# Altium project SVPXGR740_3U.PrjPcb (part 8 of 8)

## Sheet MSP430_power_jtag.SchDoc: SVPXFMC Carrier 3U
size A4; CheckedBy: \; Author: G.Kasprowicz; CompanyName: ISE; DrawnBy: T.Przywozki; Organization: WUT ISE; Address1: Warsaw University of Technology; Address2: Nowowiejska 15/19 00-665 Warsaw; Revision: 1.0.; SheetNumber: 17; SheetTotal: 20; Project: SVPXFMC Carrier 3U; ModifiedBy: -; CheckedDate: -; Title2: MSP430 power and JTAG; DivGrp: ISE; Designer: G. Kasprowicz
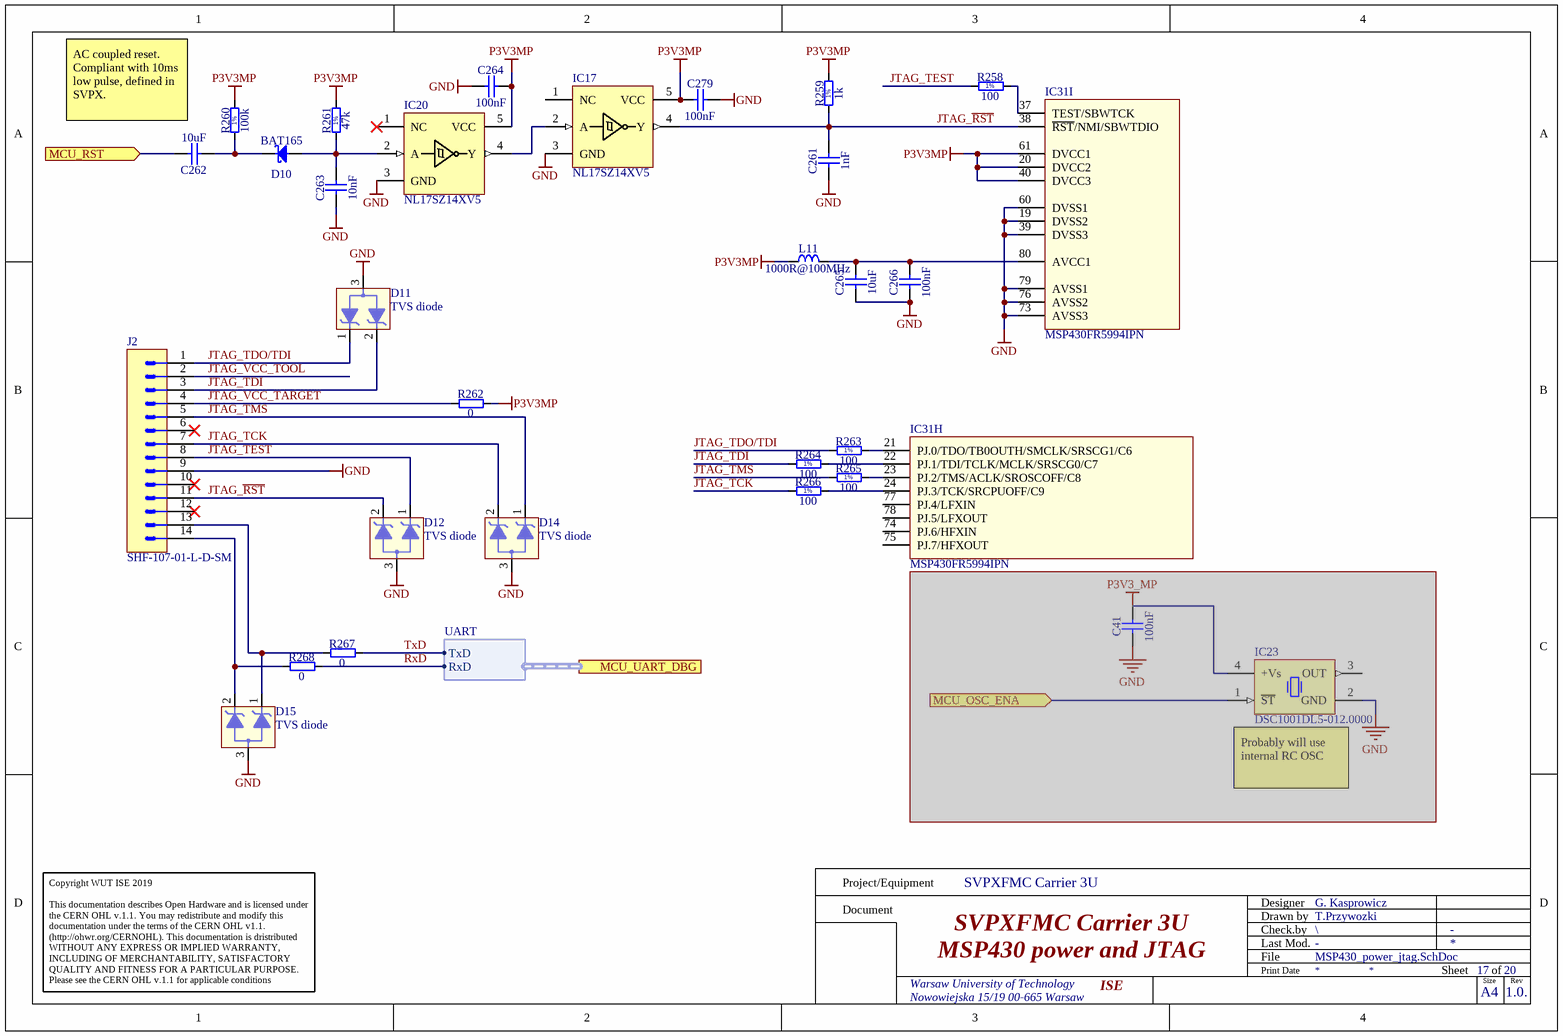
[diagram p23: MSP430_power_jtag.SchDoc]

### Parts
(Parts that share a designator on the sheet are numbered #1, #2 ... from top to bottom, then left to right.)
C41#2  100nF  [CAPC1005X55N]  (masked out: inside a compile mask, not in the netlist)
C261  1nF  [CAPC1005X55N]
C262  10uF  [CAPC1608X80N]
C263  10nF  [CAPC1005X55N]
C264  100nF  [CAPC1005X55N]
C265  10uF  [CAPC1608X80N]
C266  100nF  [CAPC1005X55N]
C279  100nF  [CAPC1005X55N]
D10  BAT165  [SOD2512X110N]
D11  TVS diode  [SOT-723_(ESD7C3.3DT5G)]
D12  TVS diode  [SOT-723_(ESD7C3.3DT5G)]
D14  TVS diode  [SOT-723_(ESD7C3.3DT5G)]
D15  TVS diode  [SOT-723_(ESD7C3.3DT5G)]
IC17  NL17SZ14XV5  [SOT50P160X60-5N]
IC20  NL17SZ14XV5  [SOT50P160X60-5N]
IC23#2  DSC1001DL5-012.0000  [OSC_MICREL_2520]  (masked out: inside a compile mask, not in the netlist)
IC31  MSP430FR5994IPN  [PQFP50P1400X1400-80N]  (parts H,I of 9)
J2  SHF-107-01-L-D-SM  [SHF-107-01-L-D-SM-LC]
L11  1000R@100MHz  [INDC1608X95N]
R258  100  [RESC1005X40N]
R259  1k  [RESC1005X40N]
R260  100k  [RESC1005X40N]
R261  47k  [RESC1005X40N]
R262  0  [RESC1608X55N]
R263  100  [RESC1005X40N]
R264  100  [RESC1005X40N]
R265  100  [RESC1005X40N]
R266  100  [RESC1005X40N]
R267  0  [RESC1608X55N]
R268  0  [RESC1608X55N]

### Ports
MCU_OSC_ENA (in), MCU_RST (in), MCU_UART_DBG (harness UART)

### Harnesses
UART: TxD, RxD

### Nets
GND: C261.1 C263.1 C264.1 C265.1 C266.1 C279.2 D11.3 D12.3 D14.3 D15.3 IC17.3(GND) IC20.3(GND) IC31.19(DVSS2) IC31.39(DVSS3) IC31.60(DVSS1) IC31.73(AVSS3) IC31.76(AVSS2) IC31.79(AVSS1) J2.9
P3V3MP: C264.2 C279.1 IC17.5(VCC) IC20.5(VCC) IC31.20(DVCC2) IC31.40(DVCC3) IC31.61(DVCC1) L11.1 R259.2 R260.2 R261.2 R262.2
JTAG_~{RST}: C261.2 D12.2 IC17.4(Y) IC31.38(~{RST}/NMI/SBWTDIO) J2.11 R259.1  [project net JTAG_~{RST}_17]
JTAG_TCK: D14.2 J2.7 R266.1  [project net JTAG_TCK_17]
JTAG_TDI: D11.2 J2.3 R264.1  [project net JTAG_TDI_17]
JTAG_TDO/TDI: D11.1 J2.1 R263.1  [project net JTAG_TDO/TDI_17]
JTAG_TEST: D12.1 J2.8 R258.1  [project net JTAG_TEST_17]
JTAG_TMS: D14.1 J2.5 R265.1  [project net JTAG_TMS_17]
JTAG_VCC_TARGET: J2.4 R262.1  [project net JTAG_VCC_TARGET_17]
JTAG_VCC_TOOL: J2.2  [project net JTAG_VCC_TOOL_17]
RxD: R268.2 ; port MCU_UART_DBG.RxD
SM2: C262.2 ; port MCU_RST
TxD: R267.2 ; port MCU_UART_DBG.TxD
NetC262_1: C262.1 D10.1(C) R260.1
NetC263_2: C263.2 D10.2(A) IC20.2(A) R261.1
NetC265_2: C265.2 C266.2 IC31.80(AVCC1) L11.2
NetD15_1: D15.1 J2.13 R267.1
NetD15_2: D15.2 J2.14 R268.1
NetIC17_2: IC17.2(A) IC20.4(Y)
NetIC31_21: IC31.21(PJ.0/TDO/TB0OUTH/SMCLK/SRSCG1/C6) R263.2
NetIC31_22: IC31.22(PJ.1/TDI/TCLK/MCLK/SRSCG0/C7) R264.2
NetIC31_23: IC31.23(PJ.2/TMS/ACLK/SROSCOFF/C8) R265.2
NetIC31_24: IC31.24(PJ.3/TCK/SRCPUOFF/C9) R266.2
NetIC31_37: IC31.37(TEST/SBWTCK) R258.2

Not connected (* = marked no-connect by the designer): IC17 1(NC); IC20 1(NC)*; IC31 74(PJ.6/HFXIN) 75(PJ.7/HFXOUT) 77(PJ.4/LFXIN) 78(PJ.5/LFXOUT); J2 6* 10* 12*

### Notes on the sheet
- AC coupled reset. Compliant with 10ms low pulse, defined in SVPX.
- (near J2) Verify JTAG connection. Documentation connects 1 pin of the connector to "TDI/TDO" pin uC.
  IO description does not contain a pin described as "TDI/TDO".
- (near IC23#2) Probably will use internal RC OSC
- Project/Equipment
- Document
- Designer
- Drawn by
- Check.by
- Copyright WUT ISE 2019
  This documentation describes Open Hardware and is licensed under the CERN OHL v.1.1. You may redistribute and modify this documentation under the terms of the CERN OHL v1.1.
  (http://ohwr.org/CERNOHL). This documentation is dristributed WITHOUT ANY EXPRESS OR IMPLIED WARRANTY, INCLUDING OF MERCHANTABILITY, SATISFACTORY QUALITY AND FITNESS FOR A PARTICULAR PURPOSE. Please see the CERN OHL v.1.1 for applicable conditions
- File
- Last Mod.
- Print Date
- Sheet
- Size
- A4
- of
- Rev
- (in symbol R0402_1K_1%_0.0625W_100PPM) 1%
- (in symbol R0402_47K_1%_0.0625W_100PPM) 1%
- (in symbol R0402_100K_1%_0.0625W_100PPM) 1%
- (in symbol R0402_100R_1%_0.0625W_100PPM) 1%

### Library data of the parts
C41#2 C264 C266 C279 = CC0402_100NF_25V_10%_X7R_YUDEN_TMK105B7104KVHF: Non-polarised capacitor; Part Description: SMD Multilayer Chip Ceramic Capacitor (High Dielectric Type) for Automotive / Industrial Applications; Manufacturer: TAIYO YUDEN; Voltage: 25V; TC: X7R; Tolerance: ±10%; Part Number: CC0402_100NF_25V_10%_X7R_YUDEN_TMK105B7104KVHF; Component Kind: Standard; Component Type: Standard; Pin Count: 2; Value: 100nF; Status: Not Recommended; Manufacturer Part Number: TMK105B7104KVHF; Case: 0402; Mounted: Yes; Socket: No; SMD: Yes; Sense: No; HelpURL: \\cern.ch\dfs\Applications\Altium\Datasheets\CC0402_TAIYO-YUDEN_TMK105B7104KVHF.pdf; Author: CERN DEM JLC; CreateDate: 10.05.2017; LatestRevisionDate: 10.05.2017; ComponentHeight: 0.55mm
C261 = CC0402_1NF_50V_10%_X7R: Non-polarised capacitor; Part Description: SMD Multilayer Chip Ceramic Capacitor; Manufacturer: GENERIC; Manufacturer1 Part Number: 223858715623; Voltage: 50V; TC: X7R; Tolerance: ±10%; Part Number: CC0402_1NF_50V_10%_X7R; Component Kind: Standard; Component Type: Standard; Pin Count: 2; Value: 1nF; Status: Not Recommended; Manufacturer Part Number: CC0402_1NF_50V_10%_X7R; Case: 0402; Mounted: Yes; Socket: No; SMD: Yes; Sense: No; Manufacturer1 Example: PHYCOMP; Manufacturer1 ComponentHeight: 0.55mm; HelpURL: \\cern.ch\dfs\Applications\Altium\Datasheets\CC0402_X7R_PHYCOMP.pdf; Author: CERN DEM JLC; CreateDate: 03.12.2007; LatestRevisionDate: 03.12.2007
C262 C265 = CC0603_10UF_16V_20%_X5R: Non-polarised capacitor; Part Description: SMD Multilayer Chip Ceramic Capacitor; Manufacturer: GENERIC; Manufacturer1 Part Number: GRM188R61C106MA73D; Voltage: 16V; TC: X5R; Tolerance: ±20%; Part Number: CC0603_10UF_16V_20%_X5R; Component Kind: Standard; Component Type: Standard; Pin Count: 2; Value: 10uF; Status: None; Manufacturer Part Number: CC0603_10UF_16V_20%_X5R; Case: 0603; Mounted: Yes; Socket: No; SMD: Yes; Sense: No; Manufacturer1 Example: MURATA; Manufacturer1 ComponentHeight: 0.8mm; HelpURL: \\cern.ch\dfs\Applications\Altium\Datasheets\CC0603_X5R_MURATA_GRM.pdf; Author: CERN DEM MR; CreateDate: 2016-03-02; LatestRevisionDate: 2016-03-02
C263 = CC0402_10NF_50V_10%_X7R: Non-polarised capacitor; Part Description: SMD Multilayer Chip Ceramic Capacitor; Manufacturer: GENERIC; Manufacturer1 Part Number: GRM155R71H103KA88D; Voltage: 50V; TC: X7R; Tolerance: ±10%; Part Number: CC0402_10NF_50V_10%_X7R; Component Kind: Standard; Component Type: Standard; Pin Count: 2; Value: 10nF; Status: None; Manufacturer Part Number: CC0402_10NF_50V_10%_X7R; Case: 0402; Mounted: Yes; Socket: No; SMD: Yes; Sense: No; Manufacturer1 Example: MURATA; Manufacturer1 ComponentHeight: 0.55mm; HelpURL: \\cern.ch\dfs\Applications\Altium\Datasheets\CC0402_X7R_MURATA_GRM.pdf; Author: CERN DEM MR; CreateDate: 08.01.2016; LatestRevisionDate: 08.01.2016
D10 = BAT165: Schottky Diode; Part Description: Medium Power AF Schottky Diode; Manufacturer: INFINEON; Voltage: 40V; Power: 750mA; PressFit: No; Bonding: No; Part Number: BAT165; Component Kind: Standard; Component Type: Standard; Device: BAT165; PackageDescription: Small Outline Diode (SOD-323), 1.70mm W X 1.25mm L X 1.10mm H body,  IPC Medium Density; Manufacturer Part Number: BAT165; Pin Count: 2; Case: SOD323; Mounted: Yes; Socket: No; SMD: Yes; Sense: No; ComponentHeight: 1.1mm; HelpURL: \\cern.ch\dfs\Applications\Altium\Datasheets\BAT165.pdf; Author: CERN DEM JLC; CreateDate: 12.11.2014; LatestRevisionDate: 12.11.2014
D11 D12 D14 D15 = ESD7C3.3DT5G: Dual TVS diode, Vrwm=3.3V; Manufacturer: ON Semiconductor; Bonding: No; ComponentHeigth: 0.5mm; PressFit: No; Value: 3.3V; Case: SOT-723; Component Kind: Standard; Component Type: Standard; CreateDate: 2018-06-18; Device: TVS diode; HelpURL: https://www.onsemi.com/pub/Collateral/ESD7C3.3D-D.PDF; LatestRevisionDate: 2018-06-18; Manufacturer Part Number: ESD7C3.3DT5G; Mounted: Yes; PackageDescription: SOT-723; Part Description: TVS diode; Part Number: ESD7C3.3DT5G; Pin Count: 3; Sense: No; SMD: Yes; Socket: No
IC17 IC20 = NL17SZ14XV5: Single inverter with schmitt trigger; Manufacturer: On Semiconductor; Bonding: No; ComponentHeigth: 0.55mm; PressFit: No; Case: SOT-553; Component Kind: Standard; Component Type: Standard; CreateDate: 2019-05-06; Device: NL17SZ14XV5; Footprint: SOT23-5; HelpURL: https://www.onsemi.com/pub/Collateral/NL17SZ14-D.PDF; LatestRevisionDate: 2018-01-01; Manufacturer Part Number: NL17SZ14XV5; Mounted: Yes; PackageDescription: Body 1.6x1.2mm, Pitch 0.5mm; Part Description: Single inverter with schmitt trigger; Part Number: NL17SZ14XV5; Pin Count: 5; Sense: No; SMD: Yes; Socket: No; Value: *
IC23#2 = DSC1001DL5-012.0000: MEMS Oscillator 12MHz; Manufacturer: Micrel; Bonding: No; PressFit: No; Case: *; Component Kind: Standard; Component Type: Standard; ComponentHeigth: *; CreateDate: 2018-05-21; Device: DSC1001DL5-012.0000; Footprint: MICREL SMD Oscillator, QFN, 4 pins, 2.5mm x 2.0mm; HelpURL: *; LatestRevisionDate: 2018-05-21; Manufacturer Part Number: DSC1001DL5-012.0000; Mounted: Yes; PackageDescription: MICREL SMD Oscillator, QFN, 4 pins, 2.5mm x 2.0mm; Part Description: MEMS Oscillator 12MHz; Part Number: DSC1001DL5-012.0000; Pin Count: 4; Sense: No; SMD: Yes; Socket: No; Value: *
IC31 = MSP430FR5994IPN: Manufacturer: TI; Part Description: FRAM microcontroller; Bonding: No; ComponentHeigth: 2mm; PressFit: No; Case: LQFP80; Component Kind: Standard; Component Type: Standard; CreateDate: 2018-01-01; Device: MSP430FR5994IPN; Footprint: LQFP80; HelpURL: *; LatestRevisionDate: 2018-01-01; Manufacturer Part Number: MSP430FR5994IPN; Mounted: Yes; PackageDescription: LQFP80; Part Number: MSP430FR5994IPN; Pin Count: 80; Sense: No; SMD: Yes; Socket: No; Value: *
J2 = SHF-107-01-L-D-SM: Header, 14 contacts, Pitch 1,27mm, Double Row, SMD; Manufacturer: Samtec; Part Description: Horizontal header, 14 contacts, Pitch 2.54mm, Double Row, SMD; Bonding: No; ComponentHeigth: 6.1mm; PressFit: No; Case: SHF-107-01-L-D-SM; Component Kind: Standard; Component Type: Standard; CreateDate: 2018-12-07; Device: SHF-107-01-L-D-SM; Footprint: SHF-107-01-L-D-SM; HelpURL: http://suddendocs.samtec.com/prints/shf-1xx-01-x-d-xx-xx-footprint.pdf; LatestRevisionDate: 2018-12-07; Manufacturer Part Number: SHF-107-01-L-D-SM; Mounted: Yes; Part Number: SHF-107-01-L-D-SM; Pin Count: 14; Sense: No; SMD: No; Socket: No; Value: *
L11 = IND0603_MURATA_BLM18HE102SN1: Inductor; Part Description: SMD EMIFIL Suppression Chip Ferrite Bead; Manufacturer: MURATA; Power: 600mA; Resistance: 0.35R; Tolerance: ±25%; Part Number: IND0603_MURATA_BLM18HE102SN1; Component Kind: Standard; Component Type: Standard; Pin Count: 2; Value: 1000R@100MHz; Status: None; Manufacturer Part Number: BLM18HE102SN1; Case: 0603; Mounted: Yes; Socket: No; SMD: Yes; Sense: No; ComponentHeight: 0.95mm; HelpURL: \\cern.ch\dfs\Applications\Altium\Datasheets\IND0603_MURATA_BLM18H.pdf; Author: CERN DEM JLC; CreateDate: 09/12/2013; LatestRevisionDate: 09/12/2013
R258 R263-R266 = R0402_100R_1%_0.0625W_100PPM: Resistor - 1%; Part Description: General Purpose Thick Film Chip Resistor; Manufacturer: GENERIC; Manufacturer1 Part Number: 232270671001L; TC: ±100ppm/°C; PressFit: No; Part Number: R0402_100R_1%_0.0625W_100PPM; Component Kind: Standard; Component Type: Standard; Pin Count: 2; Value: 100; Status: Not Recommended; Power: 0.0625W; Tolerance: ±1%; Manufacturer Part Number: R0402_100R_1%_0.0625W_100PPM; Case: 0402; Mounted: Yes; Sense: No; Socket: No; SMD: Yes; Manufacturer1 Example: YAGEO PHYCOMP; Manufacturer1 ComponentHeight: 0.4mm; HelpURL: \\cern.ch\dfs\Applications\Altium\Datasheets\R0402_Phycomp_RC0402.pdf; Author: CERN DEM JLC; CreateDate: 03.12.2007; LatestRevisionDate: 17.10.2012
R259 = R0402_1K_1%_0.0625W_100PPM: Resistor - 1%; Part Description: General Purpose Thick Film Chip Resistor; Manufacturer: GENERIC; Manufacturer1 Part Number: 232270671002L; TC: ±100ppm/°C; PressFit: No; Part Number: R0402_1K_1%_0.0625W_100PPM; Component Kind: Standard; Component Type: Standard; Pin Count: 2; Value: 1k; Status: Not Recommended; Power: 0.0625W; Tolerance: ±1%; Manufacturer Part Number: R0402_1K_1%_0.0625W_100PPM; Case: 0402; Mounted: Yes; Sense: No; Socket: No; SMD: Yes; Manufacturer1 Example: YAGEO PHYCOMP; Manufacturer1 ComponentHeight: 0.4mm; HelpURL: \\cern.ch\dfs\Applications\Altium\Datasheets\R0402_Phycomp_RC0402.pdf; Author: CERN DEM JLC; CreateDate: 03.12.2007; LatestRevisionDate: 17.10.2012
R260 = R0402_100K_1%_0.0625W_100PPM: Resistor - 1%; Part Description: General Purpose Thick Film Chip Resistor; Manufacturer: GENERIC; Manufacturer1 Part Number: 232270671004L; TC: ±100ppm/°C; PressFit: No; Part Number: R0402_100K_1%_0.0625W_100PPM; Component Kind: Standard; Component Type: Standard; Pin Count: 2; Value: 100k; Status: Not Recommended; Power: 0.0625W; Tolerance: ±1%; Manufacturer Part Number: R0402_100K_1%_0.0625W_100PPM; Case: 0402; Mounted: Yes; Sense: No; Socket: No; SMD: Yes; Manufacturer1 Example: YAGEO PHYCOMP; Manufacturer1 ComponentHeight: 0.4mm; HelpURL: \\cern.ch\dfs\Applications\Altium\Datasheets\R0402_Phycomp_RC0402.pdf; Author: CERN DEM JLC; CreateDate: 03.12.2007; LatestRevisionDate: 17.10.2012
R261 = R0402_47K_1%_0.0625W_100PPM: Resistor - 1%; Part Description: General Purpose Thick Film Chip Resistor; Manufacturer: GENERIC; Manufacturer1 Part Number: 232270675103L; TC: ±100ppm/°C; PressFit: No; Part Number: R0402_47K_1%_0.0625W_100PPM; Component Kind: Standard; Component Type: Standard; Pin Count: 2; Value: 47k; Status: Not Recommended; Power: 0.0625W; Tolerance: ±1%; Manufacturer Part Number: R0402_47K_1%_0.0625W_100PPM; Case: 0402; Mounted: Yes; Sense: No; Socket: No; SMD: Yes; Manufacturer1 Example: YAGEO PHYCOMP; Manufacturer1 ComponentHeight: 0.4mm; HelpURL: \\cern.ch\dfs\Applications\Altium\Datasheets\R0402_Phycomp_RC0402.pdf; Author: CERN DEM JLC; CreateDate: 03.12.2007; LatestRevisionDate: 17.10.2012
R262 R267 R268 = R0603_0R_JUMPER: Resistor; Part Description: 1A (0.05R Max DC Resistance) Zero Ohm Jumper; Manufacturer: GENERIC; Manufacturer1 Part Number: NRC06Z0; PressFit: No; Part Number: R0603_0R_JUMPER; Component Kind: Standard; Component Type: Standard; Pin Count: 2; Value: 0; Status: Preferred; Manufacturer Part Number: R0603_0R_JUMPER; Case: 0603; Mounted: Yes; Sense: No; Socket: No; SMD: Yes; Manufacturer1 Example: NIC COMPONENT; Manufacturer1 ComponentHeight: 0.55mm; HelpURL: \\cern.ch\dfs\Applications\Altium\Datasheets\R0603_NIC_NRC.pdf; Author: CERN DEM JLC; CreateDate: 03.12.2007; LatestRevisionDate: 13.03.2008

## Sheet Clocks_gen.SchDoc
size A4
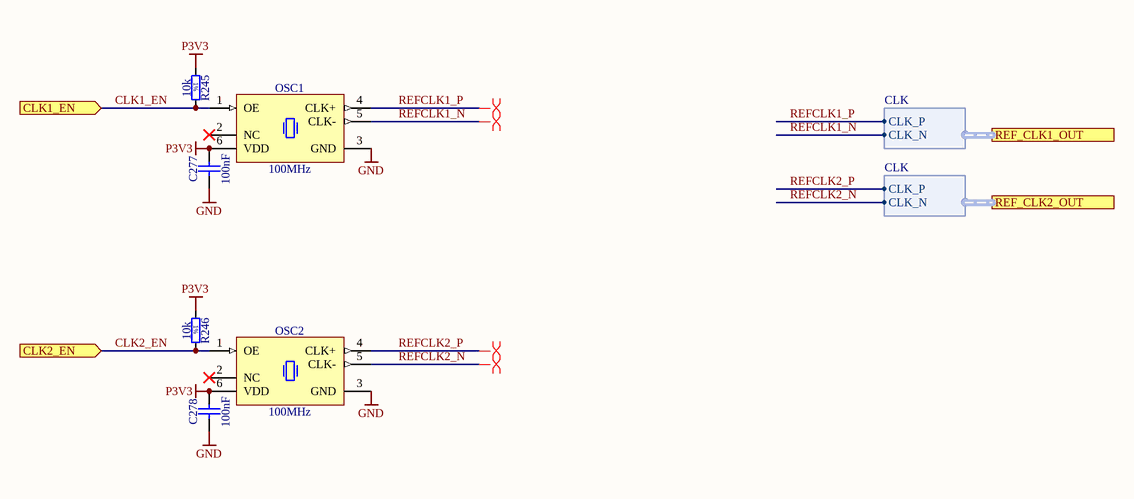
[diagram p24: Clocks_gen.SchDoc]

### Parts
C277  100nF  [CAPC1005X55N]
C278  100nF  [CAPC1005X55N]
OSC1  100MHz  [OSC_SILICON-LAB_SI531]
OSC2  100MHz  [OSC_SILICON-LAB_SI531]
R245  10k  [RESC1005X40N]
R246  10k  [RESC1005X40N]

### Ports
CLK1_EN (in), CLK2_EN (in), REF_CLK1_OUT (harness CLK), REF_CLK2_OUT (harness CLK)

### Harnesses
CLK: CLK_P, CLK_N

### Nets
GND: C277.1 C278.1 OSC1.3(GND) OSC2.3(GND)
P3V3: C277.2 C278.2 OSC1.6(VDD) OSC2.6(VDD) R245.1 R246.1  [project net 3.3V]
CLK1_EN: OSC1.1(OE) R245.2 ; port CLK1_EN
CLK2_EN: OSC2.1(OE) R246.2 ; port CLK2_EN
REFCLK1_N: OSC1.5(CLK-) ; port REF_CLK1_OUT.CLK_N  [project net REF_CLK_N]
REFCLK1_P: OSC1.4(CLK+) ; port REF_CLK1_OUT.CLK_P  [project net REF_CLK_P]
REFCLK2_N: OSC2.5(CLK-) ; port REF_CLK2_OUT.CLK_N  [project net AUX_CLK_N]
REFCLK2_P: OSC2.4(CLK+) ; port REF_CLK2_OUT.CLK_P  [project net AUX_CLK_P]

Not connected (* = marked no-connect by the designer): OSC1 2(NC)*; OSC2 2(NC)*

### Layout directives
differential pair: AUX_CLK_N, AUX_CLK_P, REF_CLK_N, REF_CLK_P

### Notes on the sheet
- (in symbol R0402_10K_1%_0.0625W_100PPM) 1%

### Library data of the parts
C277 C278 = CC0402_100NF_25V_10%_X7R_YUDEN_TMK105B7104KVHF: as C41#2 on sheet MSP430_power_jtag; Part Number: CC0402_100NF_25V_10%_X7R_YUDEN_TMK105B7104KVHF; Component Kind: Standard; Component Type: Standard; Pin Count: 2; Value: 100nF; Status: Not Recommended; Manufacturer Part Number: TMK105B7104KVHF; Case: 0402; Mounted: Yes; Socket: No; SMD: Yes; Sense: No; HelpURL: \\cern.ch\dfs\Applications\Altium\Datasheets\CC0402_TAIYO-YUDEN_TMK105B7104KVHF.pdf; Author: CERN DEM JLC; CreateDate: 10.05.2017; LatestRevisionDate: 10.05.2017; ComponentHeight: 0.55mm
OSC1 OSC2 = OSC_100MHZ_SILICON-LAB_531BC100M000DG: 10-1400MHz, Crystal Oscillator (XO), Si531 Series; Part Description: 3.3V ±20ppm LVDS Crystal Oscillator (XO), Si531 Series; Manufacturer: SILICON LABS; PressFit: No; Bonding: No; Part Number: OSC_100MHZ_SILICON-LAB_531BC100M000DG; Component Kind: Standard; Component Type: Standard; PackageDescription: Oscillator Si531 Series, 6 pins, 5x7mm; Value: 100MHz; Manufacturer Part Number: 531BC100M000DG; Pin Count: 6; Mounted: Yes; Socket: No; SMD: Yes; Sense: No; ComponentHeight: 1.8mm; HelpURL: \\cern.ch\dfs\Applications\Altium\Datasheets\OSC_SILICON-LAB_SI531.pdf; Author: CERN DEM MR; CreateDate: 2017-06-30; LatestRevisionDate: 2017-06-30
R245 R246 = R0402_10K_1%_0.0625W_100PPM: Resistor - 1%; Part Description: General Purpose Thick Film Chip Resistor; Manufacturer: GENERIC; Manufacturer1 Part Number: 232270671003L; TC: ±100ppm/°C; PressFit: No; Part Number: R0402_10K_1%_0.0625W_100PPM; Component Kind: Standard; Component Type: Standard; Pin Count: 2; Value: 10k; Status: Not Recommended; Power: 0.0625W; Tolerance: ±1%; Manufacturer Part Number: R0402_10K_1%_0.0625W_100PPM; Case: 0402; Mounted: Yes; Sense: No; Socket: No; SMD: Yes; Manufacturer1 Example: YAGEO PHYCOMP; Manufacturer1 ComponentHeight: 0.4mm; HelpURL: \\cern.ch\dfs\Applications\Altium\Datasheets\R0402_Phycomp_RC0402.pdf; Author: CERN DEM JLC; CreateDate: 03/12/2007; LatestRevisionDate: 17/10/2012

## Nets that join several sheets
3.3V: SLT3-PAY-1Q2T_P2 (D3.5), GR740 (8 pins), GR740_GPIO (16 pins), GR740_Power (79 pins), SDRAM (85 pins), Clocks (18 pins), Flash (18 pins), CON_MC_XMC_J11_64PIN (J11.19 J11.31 J11.45 J11.57), CON_MC_XMC_J12_64PIN (9 pins), CON_MC_XMC_J13_64PIN (J13.9 J13.21 J13.39 J13.57), Power (47 pins), PWR_3V3 (IC19.5 R280.2 R281.2), USB_JTAG (5 pins), Clocks_gen (6 pins)
3.3V_AUX: SLT3-PAY-1Q2T_P0 (C174.2 P0.D5), Power (C270.2 IC18.3 IC18.4 R273.1)
GND: SVPXGR740_3U (C211.2 C212.2 R150.1 R151.1), SLT3-PAY-1Q2T_P0 (14 pins), SLT3-PAY-1Q2T_P1 (41 pins), SLT3-PAY-1Q2T_P2 (41 pins), U_SVPX_protection/SpW_01_prot (T2A.1 T2A.4), U_SVPX_protection/SpW_02_prot (T2B.1 T2B.4), U_SVPX_protection/SpW_03_prot (T2C.1 T2C.4), U_SVPX_protection/SpW_04_prot (T2D.1 T2D.4), U_SVPX_protection/SpW_05_prot (T2E.1 T2E.4), U_SVPX_protection/SpW_06_prot (T2F.1 T2F.4), U_SVPX_protection/SpW_07_prot (T2G.1 T2G.4), GR740 (6 pins), GR740_GPIO (9 pins), GR740_Power (261 pins), SDRAM (96 pins), Clocks (12 pins), Flash (42 pins), CON_MC_XMC_J11_64PIN (13 pins), CON_MC_XMC_J12_64PIN (12 pins), CON_MC_XMC_J13_64PIN (18 pins), CON_MC_XMC_J14_64PIN (12 pins), Power (103 pins), PWR_3V3 (73 pins), USB_JTAG (39 pins), Management (12 pins), MSP430_power_jtag (19 pins), Clocks_gen (C277.1 C278.1 OSC1.3 OSC2.3)
P1V2: GR740_Power (120 pins), Power (16 pins)
P2V5: GR740_Power (24 pins), Power (16 pins)
P3V3MP: SLT3-PAY-1Q2T_P1 (D2.5), Power (5 pins), Management (18 pins), MSP430_power_jtag (12 pins)
VS1: SLT3-PAY-1Q2T_P0 (7 pins), Power (R269.1 R288.1), PWR_3V3 (29 pins)
AUX_CLK_N: SLT3-PAY-1Q2T_P0 (P0.C8), Clocks_gen (OSC2.5)
AUX_CLK_P: SLT3-PAY-1Q2T_P0 (P0.B8), Clocks_gen (OSC2.4)
CLK1_EN: GR740_GPIO (U1.C17), Clocks_gen (OSC1.1 R245.2)
CLK2_EN: GR740_GPIO (U1.A20), Clocks_gen (OSC2.1 R246.2)
CLK_MEM_50M: GR740_GPIO (U1.A13), Clocks (R8.2)
CLK_MIL_20M: GR740_GPIO (U1.B10), Clocks (R7.2)
CLK_SpW_50M: GR740_SpW (U1.B12), Clocks (R4.2)
CLK_SYS_50M: GR740_GPIO (U1.A12), Clocks (R6.2)
CPtp01-DA_N: SLT3-PAY-1Q2T_P2 (P2.B7), U_SVPX_protection/SpW_01_prot (D27A.2), GR740_SpW (U1.U23)
CPtp01-DA_P: SLT3-PAY-1Q2T_P2 (P2.A7), U_SVPX_protection/SpW_01_prot (D27A.1), GR740_SpW (U1.U22)
CPtp01-DB_N: SLT3-PAY-1Q2T_P2 (P2.E7), GR740_SpW (U1.T23)
CPtp01-DB_P: SLT3-PAY-1Q2T_P2 (P2.D7), GR740_SpW (U1.T22)
CPtp01-DC_N: SLT3-PAY-1Q2T_P2 (P2.C8), U_SVPX_protection/SpW_01_prot (D13A.2), GR740_SpW (U1.U25)
CPtp01-DC_P: SLT3-PAY-1Q2T_P2 (P2.B8), U_SVPX_protection/SpW_01_prot (D13A.1), GR740_SpW (U1.U24)
CPtp01-DD_N: SLT3-PAY-1Q2T_P2 (P2.F8), GR740_SpW (U1.T25)
CPtp01-DD_P: SLT3-PAY-1Q2T_P2 (P2.E8), GR740_SpW (U1.T24)
CPtp02-DA_N: SLT3-PAY-1Q2T_P2 (P2.B5), U_SVPX_protection/SpW_02_prot (D27B.2), GR740_SpW (U1.R23)
CPtp02-DA_P: SLT3-PAY-1Q2T_P2 (P2.A5), U_SVPX_protection/SpW_02_prot (D27B.1), GR740_SpW (U1.R22)
CPtp02-DB_N: SLT3-PAY-1Q2T_P2 (P2.E5), GR740_SpW (U1.P23)
CPtp02-DB_P: SLT3-PAY-1Q2T_P2 (P2.D5), GR740_SpW (U1.P22)
CPtp02-DC_N: SLT3-PAY-1Q2T_P2 (P2.C6), U_SVPX_protection/SpW_02_prot (D13B.2), GR740_SpW (U1.R25)
CPtp02-DC_P: SLT3-PAY-1Q2T_P2 (P2.B6), U_SVPX_protection/SpW_02_prot (D13B.1), GR740_SpW (U1.R24)
CPtp02-DD_N: SLT3-PAY-1Q2T_P2 (P2.F6), GR740_SpW (U1.P25)
CPtp02-DD_P: SLT3-PAY-1Q2T_P2 (P2.E6), GR740_SpW (U1.P24)
CPtp03-DA_N: SLT3-PAY-1Q2T_P2 (P2.B3), U_SVPX_protection/SpW_03_prot (D27C.2), GR740_SpW (U1.N23)
CPtp03-DA_P: SLT3-PAY-1Q2T_P2 (P2.A3), U_SVPX_protection/SpW_03_prot (D27C.1), GR740_SpW (U1.N22)
CPtp03-DB_N: SLT3-PAY-1Q2T_P2 (P2.E3), GR740_SpW (U1.M23)
CPtp03-DB_P: SLT3-PAY-1Q2T_P2 (P2.D3), GR740_SpW (U1.M22)
CPtp03-DC_N: SLT3-PAY-1Q2T_P2 (P2.C4), U_SVPX_protection/SpW_03_prot (D13C.2), GR740_SpW (U1.N25)
CPtp03-DC_P: SLT3-PAY-1Q2T_P2 (P2.B4), U_SVPX_protection/SpW_03_prot (D13C.1), GR740_SpW (U1.N24)
CPtp03-DD_N: SLT3-PAY-1Q2T_P2 (P2.F4), GR740_SpW (U1.M25)
CPtp03-DD_P: SLT3-PAY-1Q2T_P2 (P2.E4), GR740_SpW (U1.M24)
CPtp04-DA_N: SLT3-PAY-1Q2T_P2 (P2.B1), U_SVPX_protection/SpW_04_prot (D27D.2), GR740_SpW (U1.L23)
CPtp04-DA_P: SLT3-PAY-1Q2T_P2 (P2.A1), U_SVPX_protection/SpW_04_prot (D27D.1), GR740_SpW (U1.L22)
CPtp04-DB_N: SLT3-PAY-1Q2T_P2 (P2.E1), GR740_SpW (U1.K23)
CPtp04-DB_P: SLT3-PAY-1Q2T_P2 (P2.D1), GR740_SpW (U1.K22)
CPtp04-DC_N: SLT3-PAY-1Q2T_P2 (P2.C2), U_SVPX_protection/SpW_04_prot (D13D.2), GR740_SpW (U1.L25)
CPtp04-DC_P: SLT3-PAY-1Q2T_P2 (P2.B2), U_SVPX_protection/SpW_04_prot (D13D.1), GR740_SpW (U1.L24)
CPtp04-DD_N: SLT3-PAY-1Q2T_P2 (P2.F2), GR740_SpW (U1.K25)
CPtp04-DD_P: SLT3-PAY-1Q2T_P2 (P2.E2), GR740_SpW (U1.K24)
CPtp05-DA_N: SLT3-PAY-1Q2T_P1 (P1.B15), U_SVPX_protection/SpW_05_prot (D27E.2), GR740_SpW (U1.J23)
CPtp05-DA_P: SLT3-PAY-1Q2T_P1 (P1.A15), U_SVPX_protection/SpW_05_prot (D27E.1), GR740_SpW (U1.J22)
CPtp05-DB_N: SLT3-PAY-1Q2T_P1 (P1.E15), GR740_SpW (U1.H23)
CPtp05-DB_P: SLT3-PAY-1Q2T_P1 (P1.D15), GR740_SpW (U1.H22)
CPtp05-DC_N: SLT3-PAY-1Q2T_P1 (P1.C16), U_SVPX_protection/SpW_05_prot (D13E.2), GR740_SpW (U1.J25)
CPtp05-DC_P: SLT3-PAY-1Q2T_P1 (P1.B16), U_SVPX_protection/SpW_05_prot (D13E.1), GR740_SpW (U1.J24)
CPtp05-DD_N: SLT3-PAY-1Q2T_P1 (P1.F16), GR740_SpW (U1.H25)
CPtp05-DD_P: SLT3-PAY-1Q2T_P1 (P1.E16), GR740_SpW (U1.H24)
CPtp06-DA_N: SLT3-PAY-1Q2T_P1 (P1.B13), U_SVPX_protection/SpW_06_prot (D27F.2), GR740_SpW (U1.G23)
CPtp06-DA_P: SLT3-PAY-1Q2T_P1 (P1.A13), U_SVPX_protection/SpW_06_prot (D27F.1), GR740_SpW (U1.G22)
CPtp06-DB_N: SLT3-PAY-1Q2T_P1 (P1.E13), GR740_SpW (U1.F23)
CPtp06-DB_P: SLT3-PAY-1Q2T_P1 (P1.D13), GR740_SpW (U1.F22)
CPtp06-DC_N: SLT3-PAY-1Q2T_P1 (P1.C14), U_SVPX_protection/SpW_06_prot (D13F.2), GR740_SpW (U1.G25)
CPtp06-DC_P: SLT3-PAY-1Q2T_P1 (P1.B14), U_SVPX_protection/SpW_06_prot (D13F.1), GR740_SpW (U1.G24)
CPtp06-DD_N: SLT3-PAY-1Q2T_P1 (P1.F14), GR740_SpW (U1.F25)
CPtp06-DD_P: SLT3-PAY-1Q2T_P1 (P1.E14), GR740_SpW (U1.F24)
CPtp07-DA_N: SLT3-PAY-1Q2T_P1 (P1.B11), U_SVPX_protection/SpW_07_prot (D27G.2), GR740_SpW (U1.E23)
CPtp07-DA_P: SLT3-PAY-1Q2T_P1 (P1.A11), U_SVPX_protection/SpW_07_prot (D27G.1), GR740_SpW (U1.E22)
CPtp07-DB_N: SLT3-PAY-1Q2T_P1 (P1.E11), GR740_SpW (U1.D23)
CPtp07-DB_P: SLT3-PAY-1Q2T_P1 (P1.D11), GR740_SpW (U1.D22)
CPtp07-DC_N: SLT3-PAY-1Q2T_P1 (P1.C12), U_SVPX_protection/SpW_07_prot (D13G.2), GR740_SpW (U1.E25)
CPtp07-DC_P: SLT3-PAY-1Q2T_P1 (P1.B12), U_SVPX_protection/SpW_07_prot (D13G.1), GR740_SpW (U1.E24)
CPtp07-DD_N: SLT3-PAY-1Q2T_P1 (P1.F12), GR740_SpW (U1.D25)
CPtp07-DD_P: SLT3-PAY-1Q2T_P1 (P1.E12), GR740_SpW (U1.D24)
CPtp08-DA_N: GR740_SpW (U1.W23), CON_MC_XMC_J14_64PIN (J14.50)
CPtp08-DA_P: GR740_SpW (U1.W22), CON_MC_XMC_J14_64PIN (J14.48)
CPtp08-DB_N: GR740_SpW (U1.V23), CON_MC_XMC_J14_64PIN (J14.44)
CPtp08-DB_P: GR740_SpW (U1.V22), CON_MC_XMC_J14_64PIN (J14.42)
CPtp08-DC_N: GR740_SpW (U1.W25), CON_MC_XMC_J14_64PIN (J14.62)
CPtp08-DC_P: GR740_SpW (U1.W24), CON_MC_XMC_J14_64PIN (J14.60)
CPtp08-DD_N: GR740_SpW (U1.V25), CON_MC_XMC_J14_64PIN (J14.56)
CPtp08-DD_P: GR740_SpW (U1.V24), CON_MC_XMC_J14_64PIN (J14.54)
CPU_RST: GR740 (C1.2), Management (IC31.53)
CPU_TCK: GR740_GPIO (D5.4 J3.1 U1.A15), USB_JTAG (IC10.4)
CPU_TDI: GR740_GPIO (D5.3 J3.9 U1.B16), USB_JTAG (IC10.5)
CPU_TDO: GR740_GPIO (D5.6 J3.3 U1.B15), USB_JTAG (IC12.4)
CPU_TMS: GR740_GPIO (D6.1 J3.5 U1.B14), USB_JTAG (IC12.5)
DIS_LVDS: U_SVPX_protection/SpW_01_prot (T2A.2 T2A.5), U_SVPX_protection/SpW_02_prot (T2B.2 T2B.5), U_SVPX_protection/SpW_03_prot (T2C.2 T2C.5), U_SVPX_protection/SpW_04_prot (T2D.2 T2D.5), U_SVPX_protection/SpW_05_prot (T2E.2 T2E.5), U_SVPX_protection/SpW_06_prot (T2F.2 T2F.5), U_SVPX_protection/SpW_07_prot (T2G.2 T2G.5), Power (R288.2 T5.3)
ETH_COL: GR740_GPIO (U1.K5), CON_MC_XMC_J14_64PIN (J14.13)
ETH_CRS: GR740_GPIO (U1.J5), CON_MC_XMC_J14_64PIN (J14.7)
ETH_GTXCLK: GR740_GPIO (U1.M2), Clocks (R49.2)
ETH_MDC: GR740_GPIO (U1.J1), CON_MC_XMC_J14_64PIN (J14.1)
ETH_MDINT: GR740_GPIO (U1.J4), CON_MC_XMC_J14_64PIN (J14.5)
ETH_MDIO: GR740_GPIO (U1.K4), CON_MC_XMC_J14_64PIN (J14.15)
ETH_RX0: GR740_GPIO (U1.K1), CON_MC_XMC_J14_64PIN (J14.11)
ETH_RX1: GR740_GPIO (U1.L4), CON_MC_XMC_J14_64PIN (J14.19)
ETH_RX2: GR740_GPIO (U1.K2), CON_MC_XMC_J14_64PIN (J14.29)
ETH_RX3: GR740_GPIO (U1.M4), CON_MC_XMC_J14_64PIN (J14.25)
ETH_RX4: GR740_GPIO (U1.L1), CON_MC_XMC_J14_64PIN (J14.37)
ETH_RX5: GR740_GPIO (U1.M3), CON_MC_XMC_J14_64PIN (J14.27)
ETH_RX6: GR740_GPIO (U1.L2), CON_MC_XMC_J14_64PIN (J14.33)
ETH_RX7: GR740_GPIO (U1.M5), CON_MC_XMC_J14_64PIN (J14.23)
ETH_RXCLK: GR740_GPIO (U1.J2), CON_MC_XMC_J14_64PIN (J14.9)
ETH_RXDV: GR740_GPIO (U1.L5), CON_MC_XMC_J14_64PIN (J14.17)
ETH_RXER: GR740_GPIO (U1.M1), CON_MC_XMC_J14_64PIN (J14.39)
ETH_TX0: GR740_GPIO (R197.2), CON_MC_XMC_J14_64PIN (J14.43)
ETH_TX1: GR740_GPIO (R198.2), CON_MC_XMC_J14_64PIN (J14.49)
ETH_TX2: GR740_GPIO (R199.2), CON_MC_XMC_J14_64PIN (J14.45)
ETH_TX3: GR740_GPIO (R200.2), CON_MC_XMC_J14_64PIN (J14.51)
ETH_TX4: GR740_GPIO (R201.2), CON_MC_XMC_J14_64PIN (J14.55)
ETH_TX5: GR740_GPIO (R202.2), CON_MC_XMC_J14_64PIN (J14.59)
ETH_TX6: GR740_GPIO (R203.2), CON_MC_XMC_J14_64PIN (J14.57)
ETH_TX7: GR740_GPIO (R204.2), CON_MC_XMC_J14_64PIN (J14.61)
ETH_TXCLK: GR740_GPIO (R153.2), CON_MC_XMC_J14_64PIN (J14.41)
ETH_TXEN: GR740_GPIO (R205.2), CON_MC_XMC_J14_64PIN (J14.47)
ETH_TXER: GR740_GPIO (R206.2), CON_MC_XMC_J14_64PIN (J14.63)
FLASH_STS: GR740_GPIO (U1.D16), Flash (R290.2 R354.2)
GA0: SLT3-PAY-1Q2T_P0 (P0.A6), Management (IC31.44 R235.1)
GA1: SLT3-PAY-1Q2T_P0 (P0.B6), Management (IC31.45 R242.1)
GA2: SLT3-PAY-1Q2T_P0 (P0.F6), Management (IC31.46 R250.1)
GA3: SLT3-PAY-1Q2T_P0 (P0.G6), Management (IC31.47 R251.1)
GA4: SLT3-PAY-1Q2T_P0 (P0.F5), Management (IC31.48 R252.1)
GAP: SLT3-PAY-1Q2T_P0 (P0.G5), Management (IC31.49 R253.1)
GND_DET: GR740_GPIO (J3.10 R357.1), USB_JTAG (T1.1)
Imeas_P3V3: PWR_3V3 (C275.2 R283.1), Management (IC31.29)
Imeas_P3V3MP: Power (C271.2 R277.1), Management (IC31.63)
MEM_BA0: GR740_Memory (U1.AB12), SDRAM (6 pins)
MEM_BA1: GR740_Memory (U1.AE12), SDRAM (6 pins)
MEM_CAS: GR740_Memory (U1.AA12), SDRAM (6 pins)
MEM_CKE: GR740_Memory (U1.AE13), SDRAM (6 pins)
MEM_CLK_N: GR740_Memory (U1.AA25), SDRAM (IC7.2 R54.1)
MEM_CLK_OUT: GR740_Memory (U1.Y20), SDRAM (R50.1)
MEM_CLK_P: GR740_Memory (U1.AA24), SDRAM (IC7.1 R54.2)
MEM_CS: GR740_Memory (U1.AD8), SDRAM (6 pins)
MEM_DQ0: GR740_Memory (R30.2), SDRAM (U3.2)
MEM_DQ1: GR740_Memory (R295.2), SDRAM (U3.4)
MEM_DQ2: GR740_Memory (R296.2), SDRAM (U3.5)
MEM_DQ3: GR740_Memory (R297.2), SDRAM (U3.7)
MEM_DQ4: GR740_Memory (R298.2), SDRAM (U3.8)
MEM_DQ5: GR740_Memory (R299.2), SDRAM (U3.10)
MEM_DQ6: GR740_Memory (R300.2), SDRAM (U3.11)
MEM_DQ7: GR740_Memory (R301.2), SDRAM (U3.13)
MEM_DQ8: GR740_Memory (R302.2), SDRAM (U3.42)
MEM_DQ9: GR740_Memory (R303.2), SDRAM (U3.44)
MEM_DQ10: GR740_Memory (R304.2), SDRAM (U3.45)
MEM_DQ11: GR740_Memory (R305.2), SDRAM (U3.47)
MEM_DQ12: GR740_Memory (R306.2), SDRAM (U3.48)
MEM_DQ13: GR740_Memory (R307.2), SDRAM (U3.50)
MEM_DQ14: GR740_Memory (R308.2), SDRAM (U3.51)
MEM_DQ15: GR740_Memory (R309.2), SDRAM (U3.53)
MEM_DQ16: GR740_Memory (R310.2), SDRAM (U4.2)
MEM_DQ17: GR740_Memory (R311.2), SDRAM (U4.4)
MEM_DQ18: GR740_Memory (R312.2), SDRAM (U4.5)
MEM_DQ19: GR740_Memory (R314.2), SDRAM (U4.7)
MEM_DQ20: GR740_Memory (R316.2), SDRAM (U4.8)
MEM_DQ21: GR740_Memory (R318.2), SDRAM (U4.10)
MEM_DQ22: GR740_Memory (R320.2), SDRAM (U4.11)
MEM_DQ23: GR740_Memory (R321.2), SDRAM (U4.13)
MEM_DQ24: GR740_Memory (R322.2), SDRAM (U4.42)
MEM_DQ25: GR740_Memory (R323.2), SDRAM (U4.44)
MEM_DQ26: GR740_Memory (R324.2), SDRAM (U4.45)
MEM_DQ27: GR740_Memory (R326.2), SDRAM (U4.47)
MEM_DQ28: GR740_Memory (R328.2), SDRAM (U4.48)
MEM_DQ29: GR740_Memory (R329.2), SDRAM (U4.50)
MEM_DQ30: GR740_Memory (R330.2), SDRAM (U4.51)
MEM_DQ31: GR740_Memory (R331.2), SDRAM (U4.53)
MEM_DQ32: GR740_Memory (R101.2), SDRAM (U5.2)
MEM_DQ33: GR740_Memory (R102.2), SDRAM (U5.4)
MEM_DQ34: GR740_Memory (R103.2), SDRAM (U5.5)
MEM_DQ35: GR740_Memory (R104.2), SDRAM (U5.7)
MEM_DQ36: GR740_Memory (R105.2), SDRAM (U5.8)
MEM_DQ37: GR740_Memory (R106.2), SDRAM (U5.10)
MEM_DQ38: GR740_Memory (R107.2), SDRAM (U5.11)
MEM_DQ39: GR740_Memory (R108.2), SDRAM (U5.13)
MEM_DQ40: GR740_Memory (R109.2), SDRAM (U5.42)
MEM_DQ41: GR740_Memory (R110.2), SDRAM (U5.44)
MEM_DQ42: GR740_Memory (R111.2), SDRAM (U5.45)
MEM_DQ43: GR740_Memory (R112.2), SDRAM (U5.47)
MEM_DQ44: GR740_Memory (R113.2), SDRAM (U5.48)
MEM_DQ45: GR740_Memory (R114.2), SDRAM (U5.50)
MEM_DQ46: GR740_Memory (R115.2), SDRAM (U5.51)
MEM_DQ47: GR740_Memory (R116.2), SDRAM (U5.53)
MEM_DQ48: GR740_Memory (R118.2), SDRAM (U6.2)
MEM_DQ49: GR740_Memory (R120.2), SDRAM (U6.4)
MEM_DQ50: GR740_Memory (R122.2), SDRAM (U6.5)
MEM_DQ51: GR740_Memory (R124.2), SDRAM (U6.7)
MEM_DQ52: GR740_Memory (R126.2), SDRAM (U6.8)
MEM_DQ53: GR740_Memory (R128.2), SDRAM (U6.10)
MEM_DQ54: GR740_Memory (R130.2), SDRAM (U6.11)
MEM_DQ55: GR740_Memory (R132.2), SDRAM (U6.13)
MEM_DQ56: GR740_Memory (R134.2), SDRAM (U6.42)
MEM_DQ57: GR740_Memory (R136.2), SDRAM (U6.44)
MEM_DQ58: GR740_Memory (R138.2), SDRAM (U6.45)
MEM_DQ59: GR740_Memory (R140.2), SDRAM (U6.47)
MEM_DQ60: GR740_Memory (R142.2), SDRAM (U6.48)
MEM_DQ61: GR740_Memory (R144.2), SDRAM (U6.50)
MEM_DQ62: GR740_Memory (R146.2), SDRAM (U6.51)
MEM_DQ63: GR740_Memory (R148.2), SDRAM (U6.53)
MEM_DQ64: GR740_Memory (R332.1), SDRAM (U7.2)
MEM_DQ65: GR740_Memory (R333.1), SDRAM (U7.4)
MEM_DQ66: GR740_Memory (R334.1), SDRAM (U7.5)
MEM_DQ67: GR740_Memory (R335.1), SDRAM (U7.7)
MEM_DQ68: GR740_Memory (R336.1), SDRAM (U7.8)
MEM_DQ69: GR740_Memory (R337.1), SDRAM (U7.10)
MEM_DQ70: GR740_Memory (R338.1), SDRAM (U7.11)
MEM_DQ71: GR740_Memory (R339.1), SDRAM (U7.13)
MEM_DQ72: GR740_Memory (R340.1), SDRAM (U7.42)
MEM_DQ73: GR740_Memory (R341.1), SDRAM (U7.44)
MEM_DQ74: GR740_Memory (R342.1), SDRAM (U7.45)
MEM_DQ75: GR740_Memory (R343.1), SDRAM (U7.47)
MEM_DQ76: GR740_Memory (R344.1), SDRAM (U7.48)
MEM_DQ77: GR740_Memory (R345.1), SDRAM (U7.50)
MEM_DQ78: GR740_Memory (R346.1), SDRAM (U7.51)
MEM_DQ79: GR740_Memory (R347.1), SDRAM (U7.53)
MEM_DQ80: GR740_Memory (R149.1), SDRAM (U8.2)
MEM_DQ81: GR740_Memory (R154.1), SDRAM (U8.4)
MEM_DQ82: GR740_Memory (R155.1), SDRAM (U8.5)
MEM_DQ83: GR740_Memory (R156.1), SDRAM (U8.7)
MEM_DQ84: GR740_Memory (R157.1), SDRAM (U8.8)
MEM_DQ85: GR740_Memory (R158.1), SDRAM (U8.10)
MEM_DQ86: GR740_Memory (R159.1), SDRAM (U8.11)
MEM_DQ87: GR740_Memory (R160.1), SDRAM (U8.13)
MEM_DQ88: GR740_Memory (R161.1), SDRAM (U8.42)
MEM_DQ89: GR740_Memory (R162.1), SDRAM (U8.44)
MEM_DQ90: GR740_Memory (R163.1), SDRAM (U8.45)
MEM_DQ91: GR740_Memory (R164.1), SDRAM (U8.47)
MEM_DQ92: GR740_Memory (R165.1), SDRAM (U8.48)
MEM_DQ93: GR740_Memory (R166.1), SDRAM (U8.50)
MEM_DQ94: GR740_Memory (R167.1), SDRAM (U8.51)
MEM_DQ95: GR740_Memory (R168.1), SDRAM (U8.53)
MEM_DQM0: GR740_Memory (R313.1), SDRAM (U3.15)
MEM_DQM1: GR740_Memory (R315.1), SDRAM (U3.39)
MEM_DQM2: GR740_Memory (R317.1), SDRAM (U4.15)
MEM_DQM3: GR740_Memory (R319.1), SDRAM (U4.39)
MEM_DQM4: GR740_Memory (R169.1), SDRAM (U5.15)
MEM_DQM5: GR740_Memory (R170.1), SDRAM (U5.39)
MEM_DQM6: GR740_Memory (R171.1), SDRAM (U6.15)
MEM_DQM7: GR740_Memory (R172.1), SDRAM (U6.39)
MEM_DQM8: GR740_Memory (R325.1), SDRAM (U7.15)
MEM_DQM9: GR740_Memory (R327.1), SDRAM (U7.39)
MEM_DQM10: GR740_Memory (R173.1), SDRAM (U8.15)
MEM_DQM11: GR740_Memory (R174.1), SDRAM (U8.39)
MEM_RAS: GR740_Memory (U1.AD13), SDRAM (6 pins)
MEM_WE: GR740_Memory (U1.AA13), SDRAM (6 pins)
PCI_HOSTN: GR740_Memory (R98.1), CON_MC_XMC_J14_64PIN (J14.16)
PCI_INTA: GR740_Memory (R64.2), CON_MC_XMC_J11_64PIN (J11.4)
PCI_INTB: GR740_Memory (R63.2), CON_MC_XMC_J11_64PIN (J11.5)
PCI_INTC: GR740_Memory (R90.1), CON_MC_XMC_J11_64PIN (J11.6)
PCI_INTD: GR740_Memory (R88.1), CON_MC_XMC_J11_64PIN (J11.9)
PG_P1V2: Power (5 pins), Management (IC31.4)
PG_P2V5: Power (10 pins), Management (IC31.6)
PG_P3V3: Power (6 pins), Management (IC31.57)
PGP3V3: Power (R243.1), PWR_3V3 (5 pins)
PROM_A1: GR740_Memory (U1.E6), Flash (U2.32 U13.32)
PROM_A2: GR740_Memory (U1.A4), Flash (U2.28 U13.28)
PROM_A3: GR740_Memory (U1.C4), Flash (U2.27 U13.27)
PROM_A4: GR740_Memory (U1.B4), Flash (U2.26 U13.26)
PROM_A5: GR740_Memory (U1.D4), Flash (U2.25 U13.25)
PROM_A6: GR740_Memory (U1.A3), Flash (U2.24 U13.24)
PROM_A7: GR740_Memory (U1.C3), Flash (U2.23 U13.23)
PROM_A8: GR740_Memory (U1.B3), Flash (U2.22 U13.22)
PROM_A9: GR740_Memory (U1.B2), Flash (U2.20 U13.20)
PROM_A10: GR740_Memory (U1.C1), Flash (U2.19 U13.19)
PROM_A11: GR740_Memory (U1.D3), Flash (U2.18 U13.18)
PROM_A12: GR740_Memory (U1.C2), Flash (U2.17 U13.17)
PROM_A13: GR740_Memory (U1.E5), Flash (U2.13 U13.13)
PROM_A14: GR740_Memory (U1.D1), Flash (U2.12 U13.12)
PROM_A15: GR740_Memory (U1.E4), Flash (U2.11 U13.11)
PROM_A16: GR740_Memory (U1.D2), Flash (U2.10 U13.10)
PROM_A17: GR740_Memory (U1.F5), Flash (R25.2 U2.8 U13.8)
PROM_A18: GR740_Memory (U1.E1), Flash (R26.2 U2.7 U13.7)
PROM_A19: GR740_Memory (U1.F4), Flash (R27.2 U2.6 U13.6)
PROM_A20: GR740_Memory (U1.E2), Flash (R29.2 U2.5 U13.5)
PROM_A21: GR740_Memory (U1.G5), Flash (R31.2 U2.4 U13.4)
PROM_A22: GR740_Memory (U1.F1), Flash (R32.2 U2.3 U13.3)
PROM_A23: GR740_Memory (U1.G4), Flash (R33.2 U2.1 U13.1)
PROM_A24: GR740_Memory (U1.F2), Flash (R28.1 U2.30 U13.30)
PROM_CEN0: GR740_Memory (U1.H2), Flash (U2.14)
PROM_CEN1: GR740_Memory (U1.H1), Flash (U13.14)
PROM_DATA0: GR740_Memory (U1.C9), Flash (R17.1 U2.34 U13.34)
PROM_DATA1: GR740_Memory (U1.E8), Flash (R18.1 U2.36 U13.36)
PROM_DATA2: GR740_Memory (U1.A9), Flash (R19.1 U2.39 U13.39)
PROM_DATA3: GR740_Memory (U1.D8), Flash (R20.1 U2.41 U13.41)
PROM_DATA4: GR740_Memory (U1.B9), Flash (R21.1 U2.45 U13.45)
PROM_DATA5: GR740_Memory (U1.C8), Flash (R22.1 U2.47 U13.47)
PROM_DATA6: GR740_Memory (U1.A8), Flash (R23.1 U2.50 U13.50)
PROM_DATA7: GR740_Memory (U1.E7), Flash (R24.1 U2.52 U13.52)
PROM_DATA8: GR740_Memory (U1.B8), Flash (R9.1 U2.33 U13.33)
PROM_DATA9: GR740_Memory (U1.C7), Flash (R10.1 U2.35 U13.35)
PROM_DATA10: GR740_Memory (U1.A7), Flash (R11.1 U2.38 U13.38)
PROM_DATA11: GR740_Memory (U1.D7), Flash (R12.1 U2.40 U13.40)
PROM_DATA12: GR740_Memory (U1.B7), Flash (R13.1 U2.44 U13.44)
PROM_DATA13: GR740_Memory (U1.D6), Flash (R14.1 U2.46 U13.46)
PROM_DATA14: GR740_Memory (U1.A6), Flash (R15.1 U2.49 U13.49)
PROM_DATA15: GR740_Memory (U1.C6), Flash (R16.1 U2.51 U13.51)
PROM_OE: GR740_Memory (U1.C5), Flash (U2.54 U13.54)
PROM_RESET: GR740_GPIO (R353.1), Flash (U2.16 U13.16)
PROM_WEN: GR740_Memory (U1.A5), Flash (U2.55 U13.55)
RAM_A0: GR740_Memory (U1.AE8), SDRAM (6 pins)
RAM_A1: GR740_Memory (U1.AB9), SDRAM (6 pins)
RAM_A2: GR740_Memory (U1.AD9), SDRAM (6 pins)
RAM_A3: GR740_Memory (U1.AB10), SDRAM (6 pins)
RAM_A4: GR740_Memory (U1.AE9), SDRAM (6 pins)
RAM_A5: GR740_Memory (U1.AC10), SDRAM (6 pins)
RAM_A6: GR740_Memory (U1.AD10), SDRAM (6 pins)
RAM_A7: GR740_Memory (U1.AA10), SDRAM (6 pins)
RAM_A8: GR740_Memory (U1.AE10), SDRAM (6 pins)
RAM_A9: GR740_Memory (U1.AC11), SDRAM (6 pins)
RAM_A10: GR740_Memory (U1.AD11), SDRAM (6 pins)
RAM_A11: GR740_Memory (U1.AB11), SDRAM (6 pins)
RAM_A12: GR740_Memory (U1.AE11), SDRAM (6 pins)
REF_CLK_N: SLT3-PAY-1Q2T_P0 (P0.F8), Clocks_gen (OSC1.5)
REF_CLK_P: SLT3-PAY-1Q2T_P0 (P0.E8), Clocks_gen (OSC1.4)
RESET: GR740 (IC21.4 R1.2), GR740_GPIO (R47.1)
RxD: Management (IC31.9), MSP430_power_jtag (R268.2)
SM0: SLT3-PAY-1Q2T_P0 (D21.2 P0.B5), Management (IC31.52 R255.2)
SM1: SLT3-PAY-1Q2T_P0 (D21.1 P0.A5), Management (IC31.51 R254.2)
SM2: SLT3-PAY-1Q2T_P0 (D16.1 P0.G4), MSP430_power_jtag (C262.2)
SM3: SLT3-PAY-1Q2T_P0 (D16.2 P0.F4), Management (R256.1 T4.3)
SPI_MISO: GR740_GPIO (U1.B11), CON_MC_XMC_J14_64PIN (J14.4)
SPI_MOSI: GR740_GPIO (U1.A11), CON_MC_XMC_J14_64PIN (J14.8)
SPI_SCK: GR740_GPIO (U1.C11), CON_MC_XMC_J14_64PIN (J14.6)
SPI_SEL: GR740_GPIO (U1.C12), CON_MC_XMC_J14_64PIN (J14.10)
SYS_CON: SLT3-PAY-1Q2T_P1 (D2.4 P1.G5), Management (IC31.25)
SYS_CON_P: SLT3-PAY-1Q2T_P1 (D2.3 P1.G1), Management (IC31.26)
SYSRESET*: SLT3-PAY-1Q2T_P0 (P0.B4 TP26.1), GR740 (C276.2)
TxD: Management (IC31.8), MSP430_power_jtag (R267.2)
UD_OBC_SEL0: SLT3-PAY-1Q2T_P2 (D3.3 P2.G1), GR740_GPIO (R284.2)
UD_OBC_SEL1: SLT3-PAY-1Q2T_P2 (D3.4 P2.G3), GR740_GPIO (R285.2)
UD_OBC_SEL2: SLT3-PAY-1Q2T_P2 (D3.6 P2.G5), GR740_GPIO (R286.2)
Umeas_P1V2: Power (C268.2 R272.1), Management (IC31.34)
Umeas_P2V5: Power (C272.2 R278.2 R279.2), Management (IC31.33)
Umeas_P3V3: PWR_3V3 (C273.2 R281.1 R282.2), Management (IC31.32)
Umeas_P3V3MP: Power (C269.2 R275.2 R276.2), Management (IC31.64)
Umeas_P12V0: Power (C267.2 R269.2 R270.2 R271.2), Management (IC31.3)
WDOGN: GR740 (D8.1 R291.1), GR740_GPIO (U1.D19)
X_AD0: GR740_Memory (R79.2), CON_MC_XMC_J11_64PIN (J11.61)
X_AD1: GR740_Memory (R80.2), CON_MC_XMC_J11_64PIN (J11.60)
X_AD2: GR740_Memory (R81.2), CON_MC_XMC_J11_64PIN (J11.59)
X_AD3: GR740_Memory (R82.2), CON_MC_XMC_J11_64PIN (J11.58)
X_AD4: GR740_Memory (R83.2), CON_MC_XMC_J11_64PIN (J11.55)
X_AD5: GR740_Memory (R84.2), CON_MC_XMC_J11_64PIN (J11.54)
X_AD6: GR740_Memory (R85.2), CON_MC_XMC_J11_64PIN (J11.53)
X_AD7: GR740_Memory (R86.2), CON_MC_XMC_J12_64PIN (J12.51)
X_AD8: GR740_Memory (R87.2), CON_MC_XMC_J12_64PIN (J12.49)
X_AD9: GR740_Memory (R89.2), CON_MC_XMC_J11_64PIN (J11.49)
X_AD10: GR740_Memory (R91.2), CON_MC_XMC_J12_64PIN (J12.48)
X_AD11: GR740_Memory (R93.2), CON_MC_XMC_J11_64PIN (J11.48)
X_AD12: GR740_Memory (R95.2), CON_MC_XMC_J11_64PIN (J11.47)
X_AD13: GR740_Memory (R96.2), CON_MC_XMC_J12_64PIN (J12.46)
X_AD14: GR740_Memory (R97.2), CON_MC_XMC_J12_64PIN (J12.45)
X_AD15: GR740_Memory (R99.2), CON_MC_XMC_J11_64PIN (J11.46)
X_AD16: GR740_Memory (R117.1), CON_MC_XMC_J12_64PIN (J12.31)
X_AD17: GR740_Memory (R119.1), CON_MC_XMC_J11_64PIN (J11.32)
X_AD18: GR740_Memory (R121.1), CON_MC_XMC_J12_64PIN (J12.29)
X_AD19: GR740_Memory (R123.1), CON_MC_XMC_J11_64PIN (J11.29)
X_AD20: GR740_Memory (R125.1), CON_MC_XMC_J12_64PIN (J12.28)
X_AD21: GR740_Memory (R127.1), CON_MC_XMC_J11_64PIN (J11.28)
X_AD22: GR740_Memory (R129.1), CON_MC_XMC_J11_64PIN (J11.27)
X_AD23: GR740_Memory (R131.1), CON_MC_XMC_J12_64PIN (J12.26)
X_AD24: GR740_Memory (R133.1), CON_MC_XMC_J12_64PIN (J12.23)
X_AD25: GR740_Memory (R135.1), CON_MC_XMC_J11_64PIN (J11.23)
X_AD26: GR740_Memory (R137.1), CON_MC_XMC_J12_64PIN (J12.22)
X_AD27: GR740_Memory (R139.1), CON_MC_XMC_J11_64PIN (J11.22)
X_AD28: GR740_Memory (R141.1), CON_MC_XMC_J11_64PIN (J11.21)
X_AD29: GR740_Memory (R143.1), CON_MC_XMC_J12_64PIN (J12.20)
X_AD30: GR740_Memory (R145.1), CON_MC_XMC_J12_64PIN (J12.19)
X_AD31: GR740_Memory (R147.1), CON_MC_XMC_J11_64PIN (J11.20)
X_CBE0: GR740_Memory (R75.2), CON_MC_XMC_J11_64PIN (J11.52)
X_CBE1: GR740_Memory (R76.2), CON_MC_XMC_J12_64PIN (J12.43)
X_CBE2: GR740_Memory (R77.2), CON_MC_XMC_J12_64PIN (J12.32)
X_CBE3: GR740_Memory (R78.2), CON_MC_XMC_J11_64PIN (J11.26)
X_CLK: GR740_Memory (R92.1), Clocks (R5.2), CON_MC_XMC_J11_64PIN (J11.13)
X_DEVSEL: GR740_Memory (R66.2), CON_MC_XMC_J11_64PIN (J11.37)
X_FRAME: GR740_Memory (R74.2), CON_MC_XMC_J11_64PIN (J11.33)
X_GNT: GR740_Memory (R72.2), CON_MC_XMC_J11_64PIN (J11.16)
X_IDSEL: GR740_Memory (R94.1), CON_MC_XMC_J12_64PIN (J12.25)
X_IRDY: GR740_Memory (R71.2), CON_MC_XMC_J11_64PIN (J11.36)
X_M66EN: GR740_Memory (R100.1), CON_MC_XMC_J12_64PIN (J12.47)
X_PAR: GR740_Memory (R69.2), CON_MC_XMC_J11_64PIN (J11.43)
X_PERR: GR740_Memory (R68.2), CON_MC_XMC_J12_64PIN (J12.39)
X_REQ: GR740_Memory (R73.2), CON_MC_XMC_J11_64PIN (J11.17)
X_SERR: GR740_Memory (R67.2), CON_MC_XMC_J12_64PIN (J12.42)
X_STOP: GR740_Memory (R65.2), CON_MC_XMC_J12_64PIN (J12.38)
X_TRDY: GR740_Memory (R70.2), CON_MC_XMC_J12_64PIN (J12.35)

## Assembly variants
More SDRAM: not fitted R38 R63 R64 R65 R66 R67 R68 R69 R70 R71 R72 R73 R74 R75 R76 R77 R78 R79 R80 R81 R82 R83 R84 R85 R86 R87 R88 R89 R90 R91 R92 R93 R94 R95 R96 R97 R98 R99 R100 R117 R119 R121 R123 R125 R127 R129 R131 R133 R135 R137 R139 R141 R143 R145 R147 R178 R179 R180 R181 R186 R187 R188 R189
PCI: not fitted R40 R101 R102 R103 R104 R105 R106 R107 R108 R109 R110 R111 R112 R113 R114 R115 R116 R118 R120 R122 R124 R126 R128 R130 R132 R134 R136 R138 R140 R142 R144 R146 R148 R149 R154 R155 R156 R157 R158 R159 R160 R161 R162 R163 R164 R165 R166 R167 R168 R169 R170 R171 R172 R173 R174 U5 U6 U8